# EAGLE design E-P-099-R2.6 (EAGLE 7.7.0)
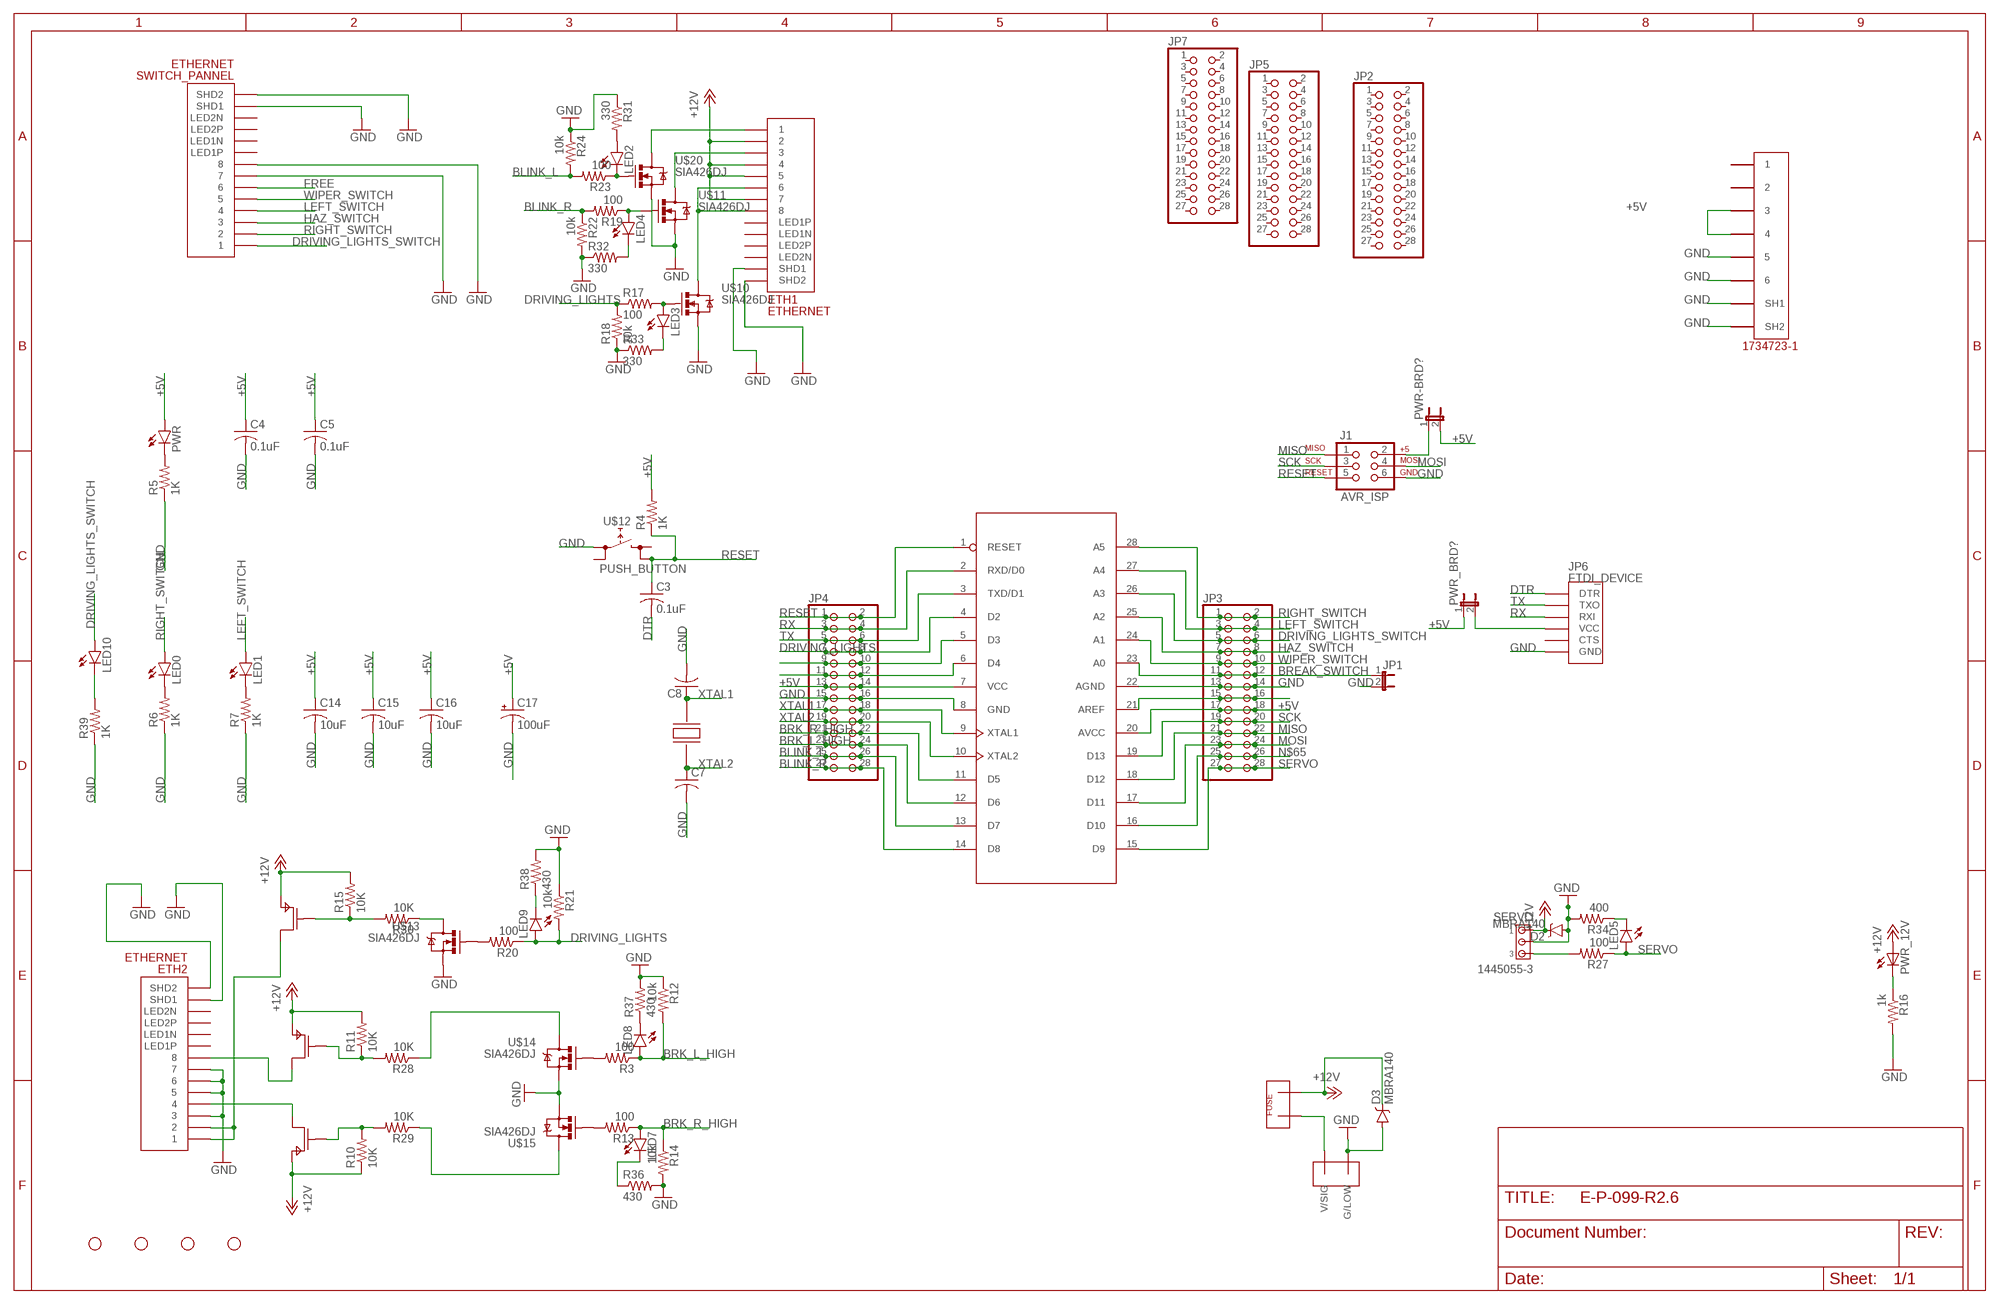
[diagram p0: schematic, sheet 1]

## Parts
C3  0.1uF  C-USC0805  [C0805]
C4  0.1uF  C-USC0805  [C0805]
C5  0.1uF  C-USC0805  [C0805]
C7  C-USC0805  [C0805]
C8  C-USC0805  [C0805]
C14  10uF  C-USC0805  [C0805]
C15  10uF  C-USC0805  [C0805]
C16  10uF  C-USC0805  [C0805]
C17  100uF  47UF-50V-20%(ELECT)  [PANASONIC_D]
D2  MBRA140  [SMA-DIODE]
D3  MBRA140  [SMA-DIODE]
ETH1  ETHERNET  [A122645-ND]
ETH2  ETHERNET  [A122645-ND]
J1  AVR_ISP  AVR_SPI_PRG_6PTH  [2X3]
JP1  JUMPER-2PTH  [1X02]
JP2  PINHD-2X14  [2X14]
JP3  PINHD-2X14  [2X14]
JP4  PINHD-2X14  [2X14]
JP5  PINHD-2X14  [2X14]
JP6  FTDI_DEVICE  [FTDI_DEVICE_SIDE]
JP7  PINHD-2X14  [2X14]
LED0  LED0603  [LED-0603]
LED1  LED0603  [LED-0603]
LED2  LED0603  [LED-0603]
LED3  LED0603  [LED-0603]
LED4  LED0603  [LED-0603]
LED5  LED0603  [LED-0603]
LED7  LED0603  [LED-0603]
LED8  LED0603  [LED-0603]
LED9  LED0603  [LED-0603]
LED10  LED0603  [LED-0603]
PWR  LED0603  [LED-0603]
PWR-BRD?  JP1E  [JP1]
PWR_12V  LEDCHIPLED_1206  [CHIPLED_1206]
PWR_BRD?  JP1E  [JP1]
R3  100  RESISTOR0805-RES  [0805]
R4  1K  RESISTOR0805-RES  [0805]
R5  1K  RESISTOR0805-RES  [0805]
R6  1K  RESISTOR0805-RES  [0805]
R7  1K  RESISTOR0805-RES  [0805]
R10  10K  RESISTOR0805-RES  [0805]
R11  10K  RESISTOR0805-RES  [0805]
R12  10k  RESISTOR0805-RES  [0805]
R13  100  RESISTOR0805-RES  [0805]
R14  10k  RESISTOR0805-RES  [0805]
R15  10K  RESISTOR0805-RES  [0805]
R16  1k  RESISTOR0805-RES  [0805]
R17  100  RESISTOR0805-RES  [0805]
R18  10k  RESISTOR0805-RES  [0805]
R19  100  RESISTOR0805-RES  [0805]
R20  100  RESISTOR0805-RES  [0805]
R21  10k  RESISTOR0805-RES  [0805]
R22  10k  RESISTOR0805-RES  [0805]
R23  100  RESISTOR0805-RES  [0805]
R24  10k  RESISTOR0805-RES  [0805]
R27  100  RESISTOR0805-RES  [0805]
R28  10K  RESISTOR0805-RES  [0805]
R29  10K  RESISTOR0805-RES  [0805]
R30  10K  RESISTOR0805-RES  [0805]
R31  330  RESISTOR0805-RES  [0805]
R32  330  RESISTOR0805-RES  [0805]
R33  330  RESISTOR0805-RES  [0805]
R34  400  RESISTOR0805-RES  [0805]
R36  430  RESISTOR0805-RES  [0805]
R37  430  RESISTOR0805-RES  [0805]
R38  430  RESISTOR0805-RES  [0805]
R39  1K  RESISTOR0805-RES  [0805]
SERVO  1445055-3  [1445055-3]
STANDOFF1  STAND-OFF  [STAND-OFF]
STANDOFF2  STAND-OFF  [STAND-OFF]
STANDOFF3  STAND-OFF  [STAND-OFF]
STANDOFF4  STAND-OFF  [STAND-OFF]
SWITCH_PANNEL  ETHERNET  [A122645-ND]
U$1  5555140-6  [1734723-1_RJ11]
U$3  SIA449DJ  [SIA449DJ-T1-GE3CT-ND]
U$4  ATMEGA328  [DIP28-0.3IN]
U$5  SIA449DJ  [SIA449DJ-T1-GE3CT-ND]
U$6  SIA449DJ  [SIA449DJ-T1-GE3CT-ND]
U$8  TE770966  [2X1-MATE-N-LOCK]
U$9  FUSEMINI-BLADE  [MINI-BLADE-FUSE]
U$10  SIA426DJ  [SC70-6L]
U$11  SIA426DJ  [SC70-6L]
U$12  PUSH_BUTTON  [PUSHBUTTON]
U$13  SIA426DJ  [SC70-6L]
U$14  SIA426DJ  [SC70-6L]
U$15  SIA426DJ  [SC70-6L]
U$18  CRYSTAL  [7A_CRYSTAL]
U$20  SIA426DJ  [SC70-6L]

## Nets
+5V: C4.1 C5.1 C14.1 C15.1 C16.1 C17.+ JP3.17 JP3.18 JP4.13 JP4.14 PWR-BRD?.2 PWR.A PWR_BRD?.1 R4.2 U$1.3 U$1.4 U$4.7(VCC) U$4.20(AVCC)
+12V: D2.C D3.C ETH1.P$2 ETH1.P$4 ETH1.P$5 ETH1.P$7 PWR_12V.A R10.1 R11.2 R15.2 SERVO.1 U$3.P$4(P$S) U$3.P$5(P$S) U$5.P$4(P$S) U$5.P$5(P$S) U$6.P$4(P$S) U$6.P$5(P$S) U$9.OUT
BLINK_L: JP4.25 JP4.26 R23.2 R24.2 U$4.13(D7)
BLINK_R: JP4.27 JP4.28 R19.2 R22.1 U$4.14(D8)
BREAK_SWITCH: JP1.1 JP3.11 JP3.12 U$4.23(A0)
BRK_L_HIGH: JP4.23 JP4.24 LED8.A R3.1 R12.2 U$4.12(D6)
BRK_R_HIGH: JP4.21 JP4.22 LED7.A R13.1 R14.1 U$4.11(D5)
DRIVING_LIGHTS: JP4.7 JP4.8 LED9.A R17.1 R18.2 R20.1 R21.2 U$4.4(D2)
DRIVING_LIGHTS_SWITCH: JP3.5 JP3.6 LED10.A SWITCH_PANNEL.P$1 U$4.26(A3)
DTR: C3.2 JP6.P$1(DTR)
FREE: SWITCH_PANNEL.P$6
GND: C4.2 C5.2 C7.2 C8.2 C14.2 C15.2 C16.2 C17.- D2.A D3.A ETH1.P$13(SHD1) ETH1.P$14(SHD2) ETH2.P$3 ETH2.P$5 ETH2.P$6 ETH2.P$7 ETH2.P$13(SHD1) ETH2.P$14(SHD2) J1.6 JP1.2 JP3.13 JP3.14 JP4.15 JP4.16 JP6.P$6(GND) R5.1 R6.1 R7.1 R12.1 R14.2 R16.2 R18.1 R21.1 R22.2 R24.1 R31.1 R32.1 R33.1 R34.2 R36.2 R37.2 R38.2 R39.1 SERVO.2 SWITCH_PANNEL.P$7 SWITCH_PANNEL.P$8 SWITCH_PANNEL.P$13(SHD1) SWITCH_PANNEL.P$14(SHD2) U$1.5 U$1.6 U$1.SH1 U$1.SH2 U$4.8(GND) U$4.22(AGND) U$8.CIRCUIT2(G/LOW) U$10.S@0(S) U$10.S@1(S) U$11.S@0(S) U$11.S@1(S) U$12.L1(L) U$13.S@0(S) U$13.S@1(S) U$14.S@0(S) U$14.S@1(S) U$15.S@0(S) U$15.S@1(S) U$20.S@0(S) U$20.S@1(S)
HAZ_SWITCH: JP3.7 JP3.8 SWITCH_PANNEL.P$3 U$4.25(A2)
LEFT_SWITCH: JP3.3 JP3.4 LED1.A SWITCH_PANNEL.P$4 U$4.27(A4)
MISO: J1.1 JP3.21 JP3.22 U$4.18(D12)
MOSI: J1.4 JP3.23 JP3.24 U$4.17(D11)
N$5: ETH2.P$4 U$6.P$1(P$D)
N$6: ETH2.P$8 U$5.P$1(P$D)
N$7: R13.2 U$15.G
N$8: R20.2 U$13.G
N$9: JP6.P$4(VCC) PWR_BRD?.2
N$10: LED0.C R6.2
N$11: LED1.C R7.2
N$13: ETH2.P$1 ETH2.P$2 U$3.P$1(P$D)
N$14: R11.1 R28.2 U$5.P$6(P$G)
N$16: PWR_12V.C R16.1
N$17: LED2.C R23.1 U$20.G
N$19: PWR.C R5.2
N$20: ETH1.P$1 U$20.D
N$21: R3.2 U$14.G
N$22: R15.1 R30.2 U$3.P$6(P$G)
N$23: ETH1.P$3 U$11.D
N$25: JP4.11 JP4.12 U$4.6(D4)
N$26: JP4.9 JP4.10 U$4.5(D3)
N$27: ETH1.P$6 ETH1.P$8 U$10.D
N$31: LED4.C R32.2
N$32: R10.2 R29.2 U$6.P$6(P$G)
N$33: LED4.A R19.1 U$11.G
N$34: R30.1 U$13.D
N$35: LED3.A R17.2 U$10.G
N$36: R27.2 SERVO.3
N$37: J1.2 PWR-BRD?.1
N$38: LED3.C R33.2
N$39: LED5.C R34.1
N$41: LED7.C R36.1
N$42: LED8.C R37.1
N$43: R28.1 U$14.D
N$44: LED9.C R38.1
N$45: R29.1 U$15.D
N$46: LED10.C R39.2
N$47: U$8.CIRCUIT1(V/SIG) U$9.IN
N$49: LED2.A R31.2
N$60: JP3.15 JP3.16 U$4.21(AREF)
N$65: JP3.25 JP3.26 U$4.16(D10)
RESET: C3.1 J1.5 JP4.1 JP4.2 R4.1 U$4.1(RESET) U$12.R2(R)
RIGHT_SWITCH: JP3.1 JP3.2 LED0.A SWITCH_PANNEL.P$2 U$4.28(A5)
RX: JP4.3 JP4.4 JP6.P$3(RXI) U$4.2(RXD/D0)
SCK: J1.3 JP3.19 JP3.20 U$4.19(D13)
SERVO: JP3.27 JP3.28 LED5.A R27.1 U$4.15(D9)
TX: JP4.5 JP4.6 JP6.P$2(TXO) U$4.3(TXD/D1)
WIPER_SWITCH: JP3.9 JP3.10 SWITCH_PANNEL.P$5 U$4.24(A1)
XTAL1: C8.1 JP4.17 JP4.18 U$4.9(XTAL1) U$18.P$2
XTAL2: C7.1 JP4.19 JP4.20 U$4.10(XTAL2) U$18.P$1
Unconnected: ETH1.P$9(LED1N) ETH1.P$10(LED1P) ETH1.P$11(LED2N) ETH1.P$12(LED2P) ETH2.P$9(LED1N) ETH2.P$10(LED1P) ETH2.P$11(LED2N) ETH2.P$12(LED2P) JP2.1 JP2.2 JP2.3 JP2.4 JP2.5 JP2.6 JP2.7 JP2.8 JP2.9 JP2.10 JP2.11 JP2.12 JP2.13 JP2.14 JP2.15 JP2.16 JP2.17 JP2.18 JP2.19 JP2.20 JP2.21 JP2.22 JP2.23 JP2.24 JP2.25 JP2.26 JP2.27 JP2.28 JP5.1 JP5.2 JP5.3 JP5.4 JP5.5 JP5.6 JP5.7 JP5.8 JP5.9 JP5.10 JP5.11 JP5.12 JP5.13 JP5.14 JP5.15 JP5.16 JP5.17 JP5.18 JP5.19 JP5.20 JP5.21 JP5.22 JP5.23 JP5.24 JP5.25 JP5.26 JP5.27 JP5.28 JP6.P$5(CTS) JP7.1 JP7.2 JP7.3 JP7.4 JP7.5 JP7.6 JP7.7 JP7.8 JP7.9 JP7.10 JP7.11 JP7.12 JP7.13 JP7.14 JP7.15 JP7.16 JP7.17 JP7.18 JP7.19 JP7.20 JP7.21 JP7.22 JP7.23 JP7.24 JP7.25 JP7.26 JP7.27 JP7.28 SWITCH_PANNEL.P$9(LED1N) SWITCH_PANNEL.P$10(LED1P) SWITCH_PANNEL.P$11(LED2N) SWITCH_PANNEL.P$12(LED2P) U$1.1 U$1.2 U$12.L2(L) U$12.R1(R)

## Library data of the parts
C3-C5 C7 C8 C14-C16 = adafruit:C-US: CAPACITOR, American symbol
C17 = SparkFun-Capacitors:47UF-50V-20%(ELECT): CAP-10547; PROD_ID: CAP-10547
D2 D3 = SparkFun-DiscreteSemi:MBRA140: 40V, 1A Schottky rectifier SMA/DO-214AC package DIO-08053; PROD_ID: DIO-08053
ETH1 ETH2 SWITCH_PANNEL = ETHERNET-3:ETHERNET: Ethernet port with 2 leds. digikey number A122645-ND
J1 = E-P-099-R2.2:AVR_SPI_PRG_6: AVR ISP 6 Pin This is the reduced ISP connector for AVR programming. Common on Arduino. This footprint will take up less PCB space and can be used with a 10-pin to 6-pin adapter such as SKU: BOB-08508
JP1 = SparkFun-Retired:JUMPER-2: Jumper Basic 0.1" spaced jumper. Use with breakaway headers.
JP2-JP5 JP7 = E-P-099-R2.2:PINHD-2X14: PIN HEADER
JP6 = SparkFun-Connectors:FTDI_DEVICE: Connector which mates to FTDI basic or FTDI cable.
LED0 LED1-LED5 LED7-LED10 PWR = SparkFun-LED:LED: LEDs Standard schematic elements and footprints for 5mm, 3mm, 1206, and 0603 sized LEDs. 5mm - Spark Fun Electronics SKU : COM-00529 (and others)
PWR-BRD? PWR_BRD? = E-P-099-R2.2:JP1E: JUMPER
PWR_12V = E14-P-099-R21.2(US_drills):LED: LED OSRAM: - CHIPLED LG R971, LG N971, LY N971, LG Q971, LY Q971, LO R971, LY R971 LH N974, LH R974 LS Q976, LO Q976, LY Q976 LO Q996 - Hyper CHIPLED LW Q18S LB Q993, LB Q99A, LB R99A - SideLED LS A670, LO A670, LY A670, LG A670, LP A670 LB A673, LV A673, LT A673, LW A673 LH A674 LY A675 LS A676, LA A676, LO A676, LY A676, LW A676 LS A679, LY A679, LG A679 - Hyper Micro SIDELED® LS Y876, LA Y876, LO Y876, LY Y876 LT Y87S - SmartLED LW L88C, LW L88S LB L89C, LB L89S, LG L890 LS L89K, LO L89K, LY L89K LS L896, LA L896, LO L896, LY L896 - TOPLED LS T670, LO T670, LY T670, LG T670, LP T670 LSG T670, LSP T670, LSY T670, LOP T670, LYG T670 LG T671, LOG T671, LSG T671 LB T673, LV T673, LT T673, LW T673 LH T674 LS T676, LA T676, LO T676, LY T676, LB T676, LH T676, LSB T676, LW T676 LB T67C, LV T67C, LT T67C, LS T67K, LO T67K, LY T67K, LW E67C LS E67B, LA E67B, LO E67B, LY E67B, LB E67C, LV E67C, LT E67C LW T67C LS T679, LY T679, LG T679 LS T770, LO T770, LY T770, LG T770, LP T770 LB T773, LV T773, LT T773, LW T773 LH T774 LS E675, LA E675, LY E675, LS T675 LS T776, LA T776, LO T776, LY T776, LB T776 LHGB T686 LT T68C, LB T68C - Hyper Mini TOPLED® LB M676 - Mini TOPLED Santana® LG M470 LS M47K, LO M47K, LY M47K Source: http://www.osram.convergy.de LUXEON: - LUMILED® LXK2-PW12-R00, LXK2-PW12-S00, LXK2-PW14-U00, LXK2-PW14-V00 LXK2-PM12-R00, LXK2-PM12-S00, LXK2-PM14-U00 LXK2-PE12-Q00, LXK2-PE12-R00, LXK2-PE12-S00, LXK2-PE14-T00, LXK2-PE14-U00 LXK2-PB12-K00, LXK2-PB12-L00, LXK2-PB12-M00, LXK2-PB14-N00, LXK2-PB14-P00, LXK2-PB14-Q00 LXK2-PR12-L00, LXK2-PR12-M00, LXK2-PR14-Q00, LXK2-PR14-R00 LXK2-PD12-Q00, LXK2-PD12-R00, LXK2-PD12-S00 LXK2-PH12-R00, LXK2-PH12-S00 LXK2-PL12-P00, LXK2-PL12-Q00, LXK2-PL12-R00 Source: www.luxeon.com KINGBRIGHT: KA-3528ASYC Source: www.kingbright.com
R3-R7 R10-R24 R27-R34 R36-R39 = SparkFun-Passives:RESISTOR: Resistor Basic schematic elements and footprints for 0603, 1206, and PTH resistors.
SERVO = con-amp:1445055-3: Micro MATE-N-LOK Connectors grid 1.5 mm Source: ENG_CD_1445055_A.pdf
STANDOFF1-STANDOFF4 = SparkFun-Electromechanical:STAND-OFF: #4 Stand Off This is the mechanical footprint for a #4 phillips button head screw. Use the keepout ring to avoid running the screw head into surrounding components. SKU : PRT-00447
U$1 = 5555140-6 RJ11:5555140-6
U$3 U$5 U$6 = Shell2015:SIA449DJ: 30V 12A P-Mosfet Digikey: SIA449DJ-T1-GE3CT-ND
U$4 = E-P-099-R2.2:ATMEGA328
U$8 = Shell2013(1):TE770966
U$9 = Shell2013:FUSE
U$10 U$11 U$13-U$15 U$20 = Shell2013:SIA426DJ
U$12 = E-P-099-R2.2:PUSH_BUTTON
U$18 = mylibrary:CRYSTAL

## Board
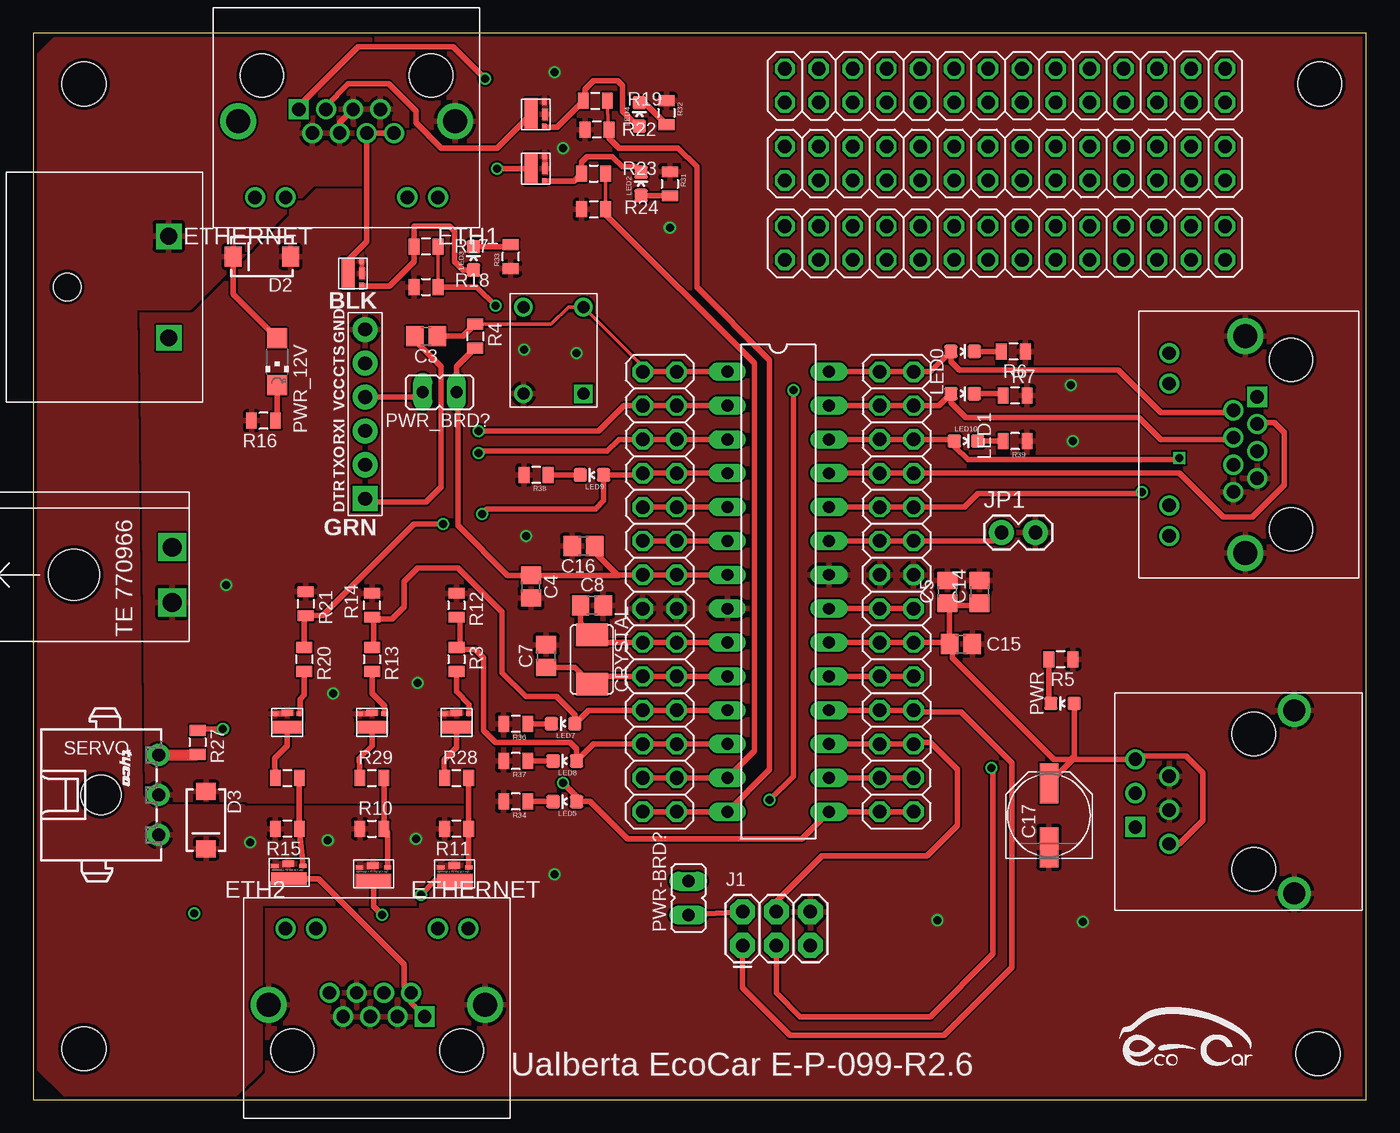
[diagram p1: board, top side]
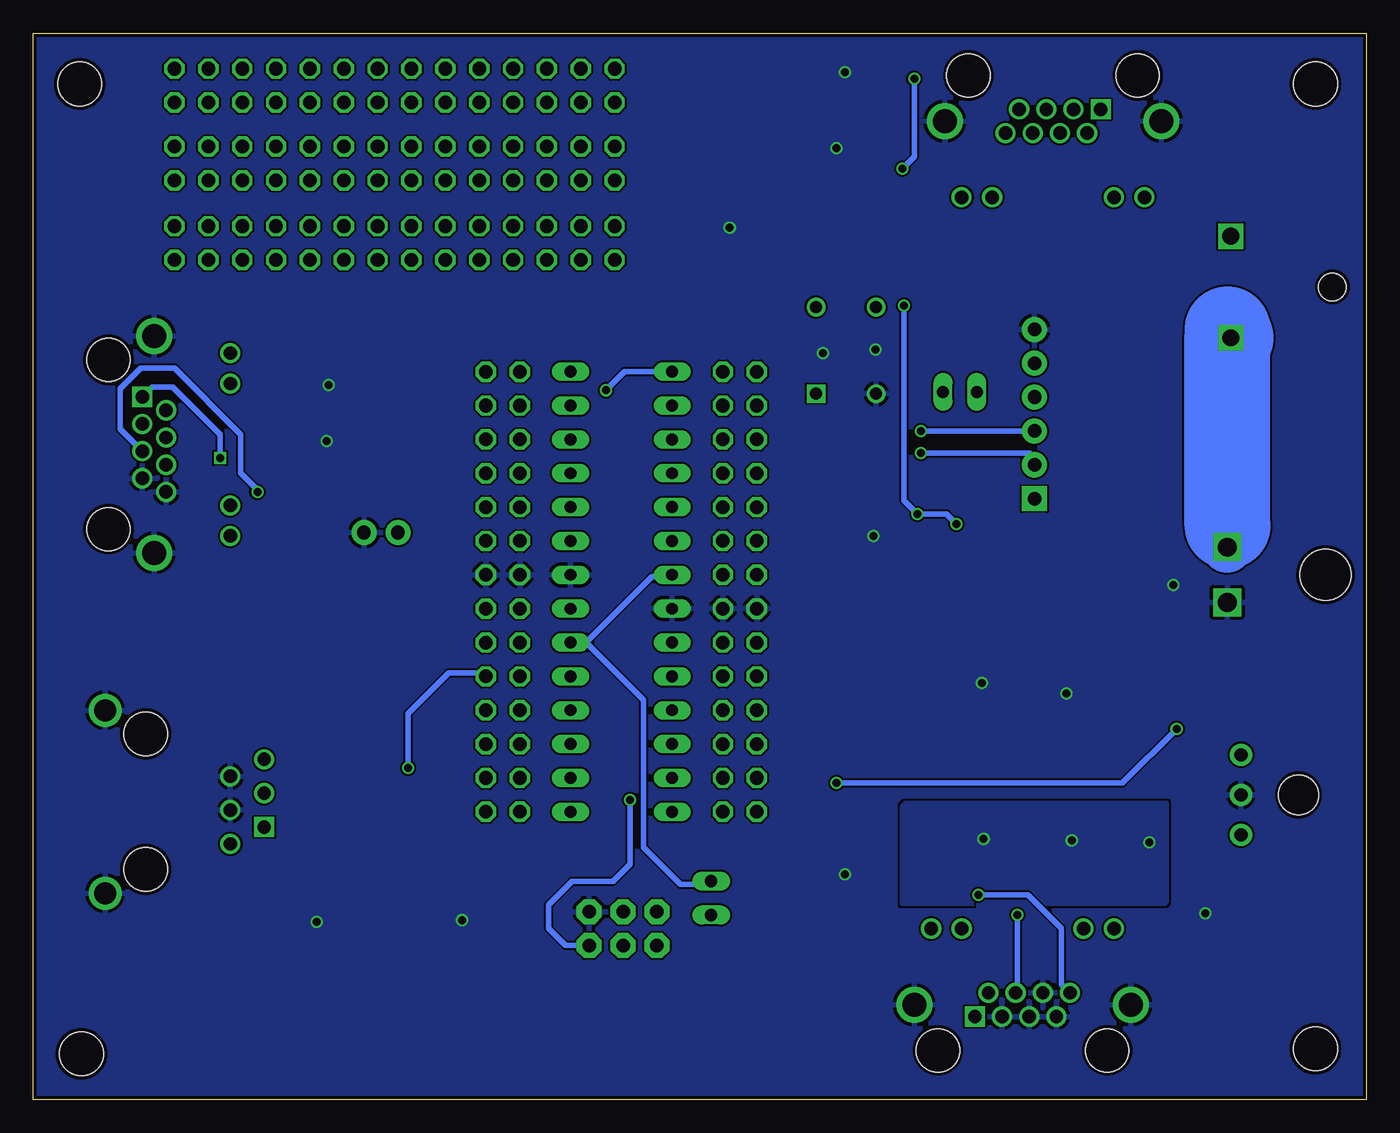
[diagram p2: board, bottom side, seen from below]

Size 100 x 80 mm. Coordinates in mm from the lower left corner, seen from the top.
Outline: 0,0 100,0 100,80 0,80 0,0
Copper layers (1*16): Top 0.035mm / dielectric 1.5mm / Bottom 0.035mm
Design rules "SeeedStudio_2layer_DRU_no_angle_20140221": minimum track width 6mil, minimum drill 12mil, track to track 6mil, track to pad 6mil, pad to pad 6mil, via to via 6mil, smd to smd 0mil, copper to edge 10mil, drill to drill 10mil, minimum pad ring 10mil, minimum via ring 6mil, stop-mask expansion 2mil, vias tented up to drill 100mil, thermal gap 10mil

### Footprints (pad centres in the part's own frame; a part is rotated, then mirrored left to right if it is on the bottom)
C0805 = smd 1.3 x 1.5: 1 -0.85,0; 2 0.85,0
PANASONIC_D = smd 3 x 1.4: + 2.4,0; - -2.4,0
SMA-DIODE = smd 1.27 x 1.47: A -2.15,0; C 2.15,0
A122645-ND = drill 1 square: P$1 3.58,2.54 | drill 1: P$2 2.56,4.32; P$3 1.54,2.54; P$4 0.52,4.32; P$5 -0.5,2.54; P$6 -1.52,4.32; P$7 -2.54,2.54; P$8 -3.56,4.32; P$9 -6.86,9.14; P$10 -4.57,9.14; P$11 4.57,9.14; P$12 6.86,9.14 | drill 1.8: P$13 -8.13,3.43; P$14 8.13,3.43 | hole 3.25: -6.35,0; 6.35,0
2X3 = drill 1.016 pad 1.88 octagon: 1 0,0; 2 0,2.54; 3 2.54,0; 4 2.54,2.54; 5 5.08,0; 6 5.08,2.54
1X02 = drill 1.016 pad 1.88: 1 0,0; 2 2.54,0
2X14 = drill 1.016 octagon: 1 -16.51,-1.27; 2 -16.51,1.27; 3 -13.97,-1.27; 4 -13.97,1.27; 5 -11.43,-1.27; 6 -11.43,1.27; 7 -8.89,-1.27; 8 -8.89,1.27; 9 -6.35,-1.27; 10 -6.35,1.27; 11 -3.81,-1.27; 12 -3.81,1.27; 13 -1.27,-1.27; 14 -1.27,1.27; 15 1.27,-1.27; 16 1.27,1.27; 17 3.81,-1.27; 18 3.81,1.27; 19 6.35,-1.27; 20 6.35,1.27; 21 8.89,-1.27; 22 8.89,1.27; 23 11.43,-1.27; 24 11.43,1.27; 25 13.97,-1.27; 26 13.97,1.27; 27 16.51,-1.27; 28 16.51,1.27
FTDI_DEVICE_SIDE = drill 1.016 pad 1.88 square: P$1 -6.35,0 | drill 1.016 pad 1.88: P$2 -3.81,0; P$3 -1.27,0; P$4 1.27,0; P$5 3.81,0; P$6 6.35,0
LED-0603 = smd 1 x 1: A 0,-0.877; C 0,0.877
JP1 = drill 0.914 long: 1 0,-1.27; 2 0,1.27
CHIPLED_1206 = smd 1.5 x 1.5: A 0,-1.75; C 0,1.75
0805 = smd 0.8 x 1.2: 1 -0.9,0; 2 0.9,0
1445055-3 = drill 1 pad 1.676: 1 3,4.32; 2 0,4.32; 3 -3,4.32 | hole 3: 0,0
STAND-OFF = hole 3.302: 0,0
1734723-1_RJ11 = drill 1 square: 1 -2.54,2.54 | drill 1: 2 0,2.54; 3 2.54,2.54; 4 -3.81,0; 5 -1.27,0; 6 1.27,0 | drill 1.65: SH1 -7.5,-9.4; SH2 6.22,-9.4 | hole 3.3: -5.72,-6.35; 4.44,-6.35
SIA449DJ-T1-GE3CT-ND = smd 0.95 x 2.67: P$1 -0.325,0 | smd 0.3 x 0.55: P$4 0.65,1.05; P$6 0.65,-1.05 | smd 0.5 x 0.87: P$5 0.8,0.04
DIP28-0.3IN = drill 0.889 long: 1 -16.51,-3.81; 2 -13.97,-3.81; 3 -11.43,-3.81; 4 -8.89,-3.81; 5 -6.35,-3.81; 6 -3.81,-3.81; 7 -1.27,-3.81; 8 1.27,-3.81; 9 3.81,-3.81; 10 6.35,-3.81; 11 8.89,-3.81; 12 11.43,-3.81; 13 13.97,-3.81; 14 16.51,-3.81; 15 16.51,3.81; 16 13.97,3.81; 17 11.43,3.81; 18 8.89,3.81; 19 6.35,3.81; 20 3.81,3.81; 21 1.27,3.81; 22 -1.27,3.81; 23 -3.81,3.81; 24 -6.35,3.81; 25 -8.89,3.81; 26 -11.43,3.81; 27 -13.97,3.81; 28 -16.51,3.81
2X1-MATE-N-LOCK = drill 1.4 square: CIRCUIT1 -2.07,14.23; CIRCUIT2 2.07,14.23 | hole 3.86: 0,6.86
MINI-BLADE-FUSE = drill 1.27 square: IN 3.81,7.62; OUT -3.81,7.62 | hole 2.083: 0,0
SC70-6L = smd 0.95 x 2.4: D 0,0 | smd 0.35 x 0.5: G 1.01,-0.95; S@0 1.01,0.95 | smd 0.45 x 0.87: S@1 1.05,0
PUSHBUTTON = drill 0.889: L1 0,4.5; R1 6.5,4.5; R2 6.5,0 | drill 0.889 square: L2 0,0
7A_CRYSTAL = smd 1.7 x 2.4: P$1 -1.85,0; P$2 1.85,0

### Placement (x,y rotation side)
C3  29.46,57.28 180 top
C4  37.34,38.48 270 top
C5  68.58,38.1 90 top
C7  38.48,33.27 90 top
C8  41.91,37.08 0 top
C14  70.99,38.1 90 top
C15  69.6,34.16 0 top
C16  41.27,41.53 180 top
C17  76.2,21.34 90 top
D2  17.14,63.25 180 top
D3  12.95,20.95 270 top
ETH1  23.5,76.83 180 top
ETH2  25.78,3.68 0 top
J1  53.21,11.56 0 top
JP1  72.64,42.55 0 top
JP2  72.9,76.07 0 top
JP3  64.77,38.1 270 top
JP4  46.99,38.1 270 top
JP5  72.9,70.23 0 top
JP6  24.89,51.44 90 top
JP7  72.9,64.26 0 top
LED0  69.72,56.13 270 top
LED1  69.72,52.96 270 top
LED2  45.59,68.71 0 top
LED3  33.02,63.12 0 top
LED4  45.47,73.91 0 top
LED5  39.88,22.35 90 top
LED7  39.75,28.19 90 top
LED8  39.88,25.4 90 top
LED9  41.91,46.86 90 top
LED10  69.98,49.4 270 top
PWR  77.22,29.72 90 top
PWR-BRD?  49.15,15.11 0 top
PWR_12V  18.29,55.37 180 top
PWR_BRD?  30.48,53.09 90 top
R3  31.75,33.02 270 top
R4  33.15,57.28 270 top
R5  77.09,33.02 180 top
R6  73.53,56.13 180 top
R7  73.66,52.83 180 top
R10  25.4,20.32 0 top
R11  31.75,20.32 180 top
R12  31.75,37.08 270 top
R13  25.4,33.02 270 top
R14  25.4,37.08 90 top
R15  19.05,20.32 180 top
R16  17.27,50.93 180 top
R17  29.46,64.01 180 top
R18  29.46,60.96 0 top
R19  42.16,74.93 0 top
R20  20.32,33.02 270 top
R21  20.45,37.21 270 top
R22  42.29,72.77 180 top
R23  42.04,69.47 0 top
R24  42.04,66.8 0 top
R27  12.32,26.8 270 top
R28  31.75,24.13 0 top
R29  25.4,24.13 0 top
R30  19.05,24.13 0 top
R31  47.75,68.71 270 top
R32  47.5,74.04 270 top
R33  35.81,63.25 90 top
R34  36.2,22.35 180 top
R36  36.2,28.19 180 top
R37  36.2,25.4 180 top
R38  37.72,46.86 180 top
R39  73.66,49.4 180 top
SERVO  5.08,22.86 270 top
STANDOFF1  96.39,3.43 0 top
STANDOFF2  96.52,76.2 0 top
STANDOFF3  3.81,3.81 0 top
STANDOFF4  3.81,76.2 0 top
SWITCH_PANNEL  94.36,49.15 90 top
U$1  85.22,22.99 90 top
U$3  19.18,16.89 90 top
U$4  55.88,38.1 270 top
U$5  31.62,16.76 90 top
U$6  25.53,16.76 90 top
U$8  -3.81,39.37 270 top
U$9  2.54,60.96 270 top
U$10  23.62,61.98 0 top
U$11  37.34,73.91 0 top
U$12  41.27,52.96 90 top
U$13  19.05,27.94 90 top
U$14  31.75,27.94 90 top
U$15  25.4,27.94 90 top
U$18  41.91,33.02 90 top
U$20  37.34,69.85 0 top

### Tracks (layer width: path | path; a pad name or v marks a point on that pad's centre or on a via)
+5V
  Top 0.406: C4.1 37.38,39.37 | C16.1 42.12,41.06 43.81,39.37 43.94,39.37 | U$4.20 JP3.17 JP3.18 68.62,34.29 C15.1 | C15.1 68.75,37.08 | 68.75,37.08 C5.1 | 68.75,37.08 70.83,37.08 C14.1 | U$4.7 JP4.14 JP4.13 43.94,39.37 | C4.1 43.9,39.33 43.94,39.37 | C4.1 35.6,39.33 31.88,43.05 31.88,52.96 PWR_BRD?.1 31.75,54.98 R4.2 | U$1.4 85.98,19.18 87.76,20.95 87.76,24.51 86.49,25.78 82.93,25.78 U$1.3 77.99,25.53 | 77.99,25.53 C17.+ | 77.99,25.53 77.85,25.53 | 77.85,25.53 76.58,25.53 68.96,33.15 68.96,33.95 C15.1 | PWR.A 78.09,25.77 77.85,25.53
  Bottom 0.406: U$4.20 58.55,34.29 | 58.55,34.29 53.59,39.24 52.2,39.24 U$4.7 | PWR-BRD?.2 49.4,16.13 51.44,16.13 54.23,18.92 54.23,29.97 58.55,34.29
+12V  (via drill 0.6)
  Top 0.152: 21,72.5 ETH1.P$2
  Top 0.406: D2.C 14.99,60.41 PWR_12V.A | ETH1.P$4 22.98,73.28 ETH1.P$5
  other vias: 16.26,19.3 22.1,19.43 28.7,19.56
  pour Top: 16.13,21.84 34.42,21.84 34.42,14.73 16.13,14.73
  pour Top (rank 3): 7.62,59.44 11.68,59.44 20.95,68.71 26.42,68.71 28.07,70.61 27.94,76.83 25.27,79.5 1.65,79.5 0.38,78.23 0.38,2.41 2.41,0.38 15.11,0.38 17.02,2.29 17.02,20.7 15.75,21.97 8.76,21.97 8,22.73
  pour Bottom: 14.99,22.23 14.99,14.86 15.11,14.73 34.8,14.73 34.8,21.97 34.54,22.23 15.37,22.23 15.11,22.23
BLINK_L
  Top 0.254: R23.2 R24.2
  Top 0.406: R24.2 42.94,66.41 54.1,55.24 54.1,26.16 U$4.13 JP4.26 JP4.25
BLINK_R
  Top 0.254: R19.2 43.11,72.9 R22.1
  Top 0.406: JP4.27 JP4.28 U$4.14 55.24,24.77 55.24,55.5 49.78,60.96 49.78,69.98 48.39,71.37 43.94,71.37 43.19,72.12 R22.1
BREAK_SWITCH
  Top 0.406: U$4.23 JP3.11 JP3.12 72.01,41.91 JP1.1
BRK_L_HIGH
  Top 0.152: 32,34 R3.1
  Top 0.406: R3.1 31.89,33.78 33.15,33.78 33.78,33.15 33.78,27.69 34.67,26.8 40.26,26.8 40.76,26.3 LED8.A 42.02,26.67 JP4.23 JP4.24 U$4.12 | 32,34 32,35.93 R12.2
BRK_R_HIGH
  Top 0.406: 25.52,36.07 26.92,36.07 27.81,36.96 27.81,38.86 28.83,39.88 31.88,39.88 35.18,36.58 35.18,32 36.96,30.23 39.24,30.23 40.63,28.84 LED7.A 41.64,29.21 JP4.21 JP4.22 U$4.11 | 25.52,36.07 R14.1 | 25.52,36.07 25.52,34.04 R13.1
DRIVING_LIGHTS  (via drill 0.6)
  Top 0.254: R18.2 R17.1
  Top 0.406: R20.1 20.32,36.13 R21.2 20.46,36.32 21.72,36.32 28.57,43.18 v30.73,43.18 | U$4.4 JP4.8 JP4.7 45.59,46.86 LED9.A 42.79,44.95 42.16,44.32 34.04,44.32 v33.66,43.94 | R18.2 33.27,60.96 v34.67,59.56
  Bottom 0.406: v30.73,43.18 31.5,43.94 v33.66,43.94 34.67,44.96 v34.67,59.56
DRIVING_LIGHTS_SWITCH  (via drill 0.6)
  Top 0.406: U$4.26 JP3.5 JP3.6 68.97,49.53 LED10.A 69.1,49.01 70.1,48.01 85.85,48.01 v85.98,48.13
  Bottom 0.406: v85.98,48.13 85.98,49.91 89.53,53.47 91.08,53.47 SWITCH_PANNEL.P$1
DTR
  Top 0.406: C3.2 28.61,56.98 30.61,54.99 30.61,45.97 29.46,44.83 25.15,44.83 JP6.P$1
GND  (via drill 0.6)
  Top 0.305: U$10.S@0 24.63,62.07 arc45 U$10.S@1
  Top 0.406: 68.16,39.37 C5.2 | U$20.S@0 38.39,70.76 U$20.S@1 | U$13.S@0 19.01,28.95 U$13.S@1 | U$15.S@0 25.36,28.95 U$15.S@1 | U$14.S@0 31.71,28.95 U$14.S@1
  Bottom 0.152: 27.5,6.25 27.37,6.27
  other vias: 36.83,56.26 40.77,56.01 47.75,65.41 39.75,71.37 39.12,77.09 77.85,53.59 77.98,49.4 36.96,42.29 28.83,31.24 22.48,30.48 14.48,38.61 12.06,13.97 39.12,16.89 67.82,13.46 78.74,13.34
  pour Bottom (rank 5): -11.43,91.44 101.6,91.44 101.6,-5.08 -11.43,-5.08
  pour Top (rank 6): -24.13,92.71 104.14,92.71 104.14,-16.51 -24.13,-16.51
HAZ_SWITCH
  Top 0.406: U$4.25 JP3.7 JP3.8 85.98,46.99 89.28,43.69 91.44,43.69 93.85,46.1 93.85,50.04 93.09,50.8 91.93,50.8 SWITCH_PANNEL.P$3
LEFT_SWITCH
  Top 0.406: U$4.27 JP3.3 JP3.4 67.96,52.07 LED1.A 68.85,52.31 69.98,51.18 82.93,51.18 84.58,49.53 89.9,49.53 SWITCH_PANNEL.P$4
MISO
  Top 0.406: J1.1 53.21,8.38 56.77,4.83 68.33,4.83 73.41,9.91 73.41,25.27 69.6,29.08 66.17,29.08 JP3.22 JP3.21 U$4.18
MOSI
  Top 0.406: J1.4 55.75,14.86 59.18,18.29 67.06,18.29 69.34,20.57 69.34,24.77 67.31,26.8 66.17,26.8 JP3.24 JP3.23 U$4.17
N$5  (via drill 0.6)
  Top 0.406: U$6.P$1 25.53,14.48 v26.16,13.84
  Bottom 0.406: v26.16,13.84 26.16,8.14 ETH2.P$4
N$6  (via drill 0.6)
  Top 0.406: U$5.P$1 30.16,16.44 v29.08,15.37
  Bottom 0.406: v29.08,15.37 25.4,15.37 22.86,12.83 22.86,8.64 ETH2.P$8
N$7
  Top 0.406: U$15.G 26.35,29.53 25.4,30.48 R13.2
N$8
  Top 0.406: U$13.G 20,30.03 20.32,30.35 R20.2
N$9
  Top 0.406: JP6.P$4 28.83,52.7 PWR_BRD?.2
N$10
  Top 0.406: LED0.C R6.2
N$11
  Top 0.406: LED1.C 72.63,52.96 R7.2
N$13
  Top 0.406: U$3.P$1 21.41,16.57 27.81,10.16 27.81,8.53 ETH2.P$2 28.34,7.24 ETH2.P$1
N$14
  Top 0.406: U$5.P$6 R11.1 R28.2
N$16
  Top 0.406: PWR_12V.C 18.29,50.99 R16.1
N$17
  Top 0.406: U$20.G 40.57,68.9 R23.1 41.14,70.35 41.53,70.74 43.43,70.74 44.2,69.98 45.2,69.98 LED2.C
N$19
  Top 0.406: R5.2 76.19,29.87 PWR.C
N$20  (via drill 0.6)
  Top 0.406: ETH1.P$1 19.91,74.53 24.38,78.99 31.5,78.99 v33.91,76.58 | v34.8,69.85 U$20.D
  Bottom 0.406: v33.91,76.58 33.91,70.74 v34.8,69.85
N$21
  Top 0.406: U$14.G 32.7,29.66 31.75,30.61 R3.2
N$22
  Top 0.406: R30.2 R15.1 U$3.P$6
N$23
  Top 0.406: ETH1.P$3 21.95,74.53 23.62,76.2 26.67,76.2 28.7,74.17 28.7,73.28 30.61,71.37 34.8,71.37 U$11.D
N$25
  Top 0.406: JP4.11 JP4.12 | JP4.12 48.64,41.91 48.77,42.04 48.39,42.04 JP4.12 | JP4.12 U$4.6
N$26
  Top 0.406: JP4.9 JP4.10 U$4.5
N$27
  Top 0.406: U$10.D 23.62,62.99 25.02,64.39 ETH1.P$6 ETH1.P$8
N$31
  Top 0.406: LED4.C 45.85,74.79 R32.2
N$32
  Top 0.406: R29.2 R10.2 26.58,20.04 U$6.P$6
N$33
  Top 0.406: U$11.G 39.3,72.96 R19.1 41.4,75.07 41.4,75.82 42.04,76.45 43.81,76.45 44.2,76.07 44.2,74.17 45.33,73.04 LED4.A
N$34
  Top 0.406: R30.1 18.1,25.59 19.05,26.54 U$13.D
N$35
  Top 0.406: U$10.G 26.74,61.03 28.57,62.87 28.57,64 R17.2 28.56,65.52 28.57,65.53 31.24,65.53 31.62,65.15 31.62,62.87 32.26,62.23 33.01,62.23 LED3.A
N$36
  Top 0.813: SERVO.3 12.31,25.86 R27.2
N$37
  Top 0.406: PWR-BRD?.1 J1.2
N$38
  Top 0.406: LED3.C 35.66,64 R33.2
N$39
  Top 0.406: LED5.C R34.1
N$41
  Top 0.406: LED7.C R36.1
N$42
  Top 0.406: LED8.C R37.1
N$43
  Top 0.406: R28.1 30.8,25.47 31.75,26.42 U$14.D
N$44
  Top 0.406: R38.1 LED9.C
N$45
  Top 0.406: R29.1 24.45,25.59 25.4,26.54 U$15.D
N$46
  Top 0.406: LED10.C R39.2
N$47
  Bottom 3.81: U$8.CIRCUIT1 10.42,43.05 10.41,43.05
  Bottom 6.452: 10.41,43.05 10.41,57.4 | 10.41,57.78 10.41,57.4 | 10.41,57.4 U$9.IN
N$49
  Top 0.406: LED2.A 47.73,67.83 R31.2
N$60
  Top 0.406: U$4.21 JP3.15 JP3.16
N$65
  Top 0.406: U$4.16 JP3.25 JP3.26
RESET  (via drill 0.6)
  Top 0.254: 45.72,55.01 U$12.R2 40.16,59.46 38.86,58.17 33.21,58.17 R4.1
  Top 0.406: U$4.1 JP4.2 JP4.1 45.72,55.01 | v57.02,53.21 57.02,24.26 v55.24,22.48 | C3.1 32.25,57.28 R4.1
  Bottom 0.406: U$4.1 55.63,54.61 v57.02,53.21 | v55.24,22.48 55.24,17.65 56.52,16.38 59.56,16.38 61.34,14.61 61.34,12.83 60.07,11.56 J1.5
RIGHT_SWITCH
  Top 0.406: U$4.28 JP3.1 JP3.2 67.32,54.61 LED0.A 68.85,55.36 69.47,54.74 81.41,54.74 84.58,51.56 89.89,51.56 SWITCH_PANNEL.P$2
RX  (via drill 0.6)
  Top 0.406: U$4.2 JP4.4 JP4.3 44.32,52.07 42.42,50.16 v33.4,50.16
  Bottom 0.406: v33.4,50.16 JP6.P$3
SCK  (via drill 0.6)
  Top 0.406: U$4.19 JP3.19 JP3.20 | J1.3 55.75,8 57.53,6.22 67.31,6.22 72.01,10.92 72.01,24.77 v71.88,24.89
  Bottom 0.406: v71.88,24.89 71.88,28.96 68.83,32 66.29,32 JP3.20
SERVO  (via drill 0.6)
  Top 0.406: v39.75,23.75 40.76,22.75 LED5.A 41.78,22.35 44.58,19.56 57.66,19.56 U$4.15 | v14.22,27.81 12.44,27.81 R27.1 | JP3.28 JP3.27 U$4.15 | 59.31,21.97 U$4.15
  Bottom 0.406: v39.75,23.75 18.29,23.75 v14.22,27.81
TX  (via drill 0.6)
  Top 0.406: U$4.3 JP4.6 JP4.5 43.94,49.53 43.05,48.64 33.53,48.64 v33.4,48.51
  Bottom 0.406: v33.4,48.51 25.27,48.51 24.26,47.5 24.77,47.5 JP6.P$2
WIPER_SWITCH  (via drill 0.6)
  Top 0.406: U$4.24 JP3.9 JP3.10 69.85,44.45 70.87,45.47 83.06,45.47 v83.19,45.59
  Bottom 0.406: v83.19,45.59 83.19,45.72 84.45,46.99 84.45,49.91 89.41,54.86 91.95,54.86 93.47,53.34 93.47,50.3 SWITCH_PANNEL.P$5
XTAL1
  Top 0.406: C8.1 41.06,35.72 U$18.P$2 42.49,34.29 JP4.17 JP4.18 U$4.9
XTAL2
  Top 0.406: C7.1 40.66,32.42 U$18.P$1 42.49,31.75 JP4.19 JP4.20 U$4.10

### Text on the board
tPlace: Ualberta EcoCar E-P-099-R2.6